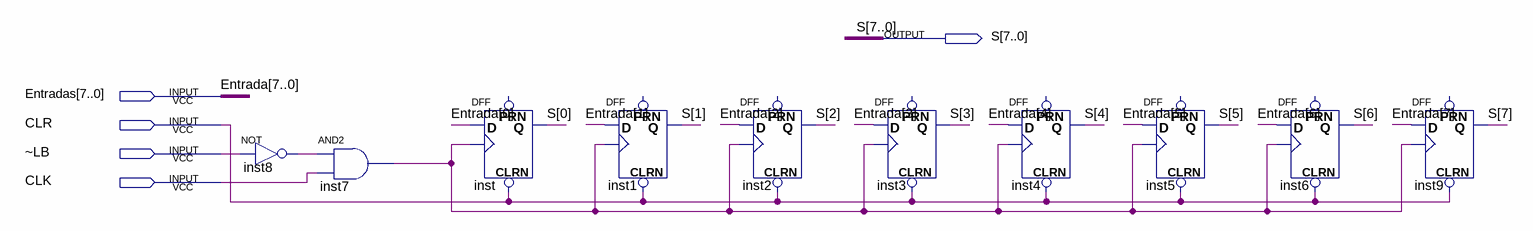
[diagram p0: schematic sheet]
// Quartus schematic Registrador_B.bdf as structural Verilog: 10 symbols, 5 pins
module Registrador_B (
  input  [7:0] Entradas,
  input  CLR,
  input  \~LB ,
  input  CLK,
  output [7:0] S
);

  wire inst7_out, inst8_out;

  not inst8 (inst8_out, \~LB );
  and inst7 (inst7_out, inst8_out, CLK);
  DFF inst (.CLRN(CLR), .CLK(inst7_out), .D(Entradas[0]), .Q(S[0]));  // open: PRN
  DFF inst1 (.CLRN(CLR), .CLK(inst7_out), .D(Entradas[1]), .Q(S[1]));  // open: PRN
  DFF inst2 (.CLRN(CLR), .CLK(inst7_out), .D(Entradas[2]), .Q(S[2]));  // open: PRN
  DFF inst3 (.CLRN(CLR), .CLK(inst7_out), .D(Entradas[3]), .Q(S[3]));  // open: PRN
  DFF inst4 (.CLRN(CLR), .CLK(inst7_out), .D(Entradas[4]), .Q(S[4]));  // open: PRN
  DFF inst5 (.CLRN(CLR), .CLK(inst7_out), .D(Entradas[5]), .Q(S[5]));  // open: PRN
  DFF inst6 (.CLRN(CLR), .CLK(inst7_out), .D(Entradas[6]), .Q(S[6]));  // open: PRN
  DFF inst9 (.CLRN(CLR), .CLK(inst7_out), .D(Entradas[7]), .Q(S[7]));  // open: PRN

  // Other names for the same wires on the sheet: Entrada[7:0] = Entradas
endmodule
